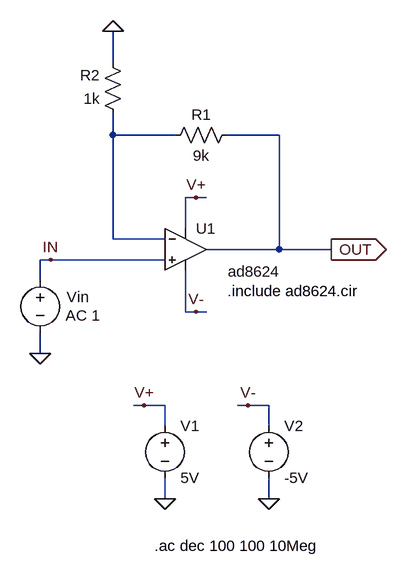
[diagram p0: schematic ad8624_test.asc]
ad8624_test.asc, the LTspice schematic file:
Version 4
SHEET 1 880 680
WIRE 0 -192 0 -240
WIRE 0 -80 0 -112
WIRE 96 -80 0 -80
WIRE 256 -80 176 -80
WIRE 128 16 112 16
WIRE 144 16 128 16
WIRE 112 64 112 16
WIRE 0 80 0 -80
WIRE 80 80 0 80
WIRE 256 96 256 -80
WIRE 256 96 144 96
WIRE 336 96 256 96
WIRE -96 112 -112 112
WIRE 80 112 -96 112
WIRE -112 144 -112 112
WIRE 112 192 112 128
WIRE 128 192 112 192
WIRE 144 192 128 192
WIRE -112 256 -112 224
WIRE 48 336 32 336
WIRE 80 336 48 336
WIRE 208 336 192 336
WIRE 240 336 208 336
WIRE 80 368 80 336
WIRE 240 368 240 336
WIRE 80 480 80 448
WIRE 240 480 240 448
FLAG 80 480 0
FLAG 240 480 0
FLAG 48 336 V+
FLAG 208 336 V-
FLAG 128 16 V+
FLAG 128 192 V-
FLAG -112 256 0
FLAG 336 96 OUT
IOPIN 336 96 Out
FLAG -96 112 IN
FLAG 0 -240 0
SYMBOL Opamps\\opamp2 112 32 R0
WINDOW 3 65 98 Left 2
SYMATTR Value ad8624
SYMATTR InstName U1
SYMBOL voltage 80 352 R0
SYMATTR InstName V1
SYMATTR Value 5V
SYMBOL voltage 240 352 R0
SYMATTR InstName V2
SYMATTR Value -5V
SYMBOL voltage -112 128 R0
WINDOW 0 41 41 Left 2
WINDOW 123 39 70 Left 2
WINDOW 39 0 0 Left 2
SYMATTR InstName Vin
SYMATTR Value2 AC 1
SYMATTR Value ""
SYMBOL res 192 -96 R90
WINDOW 0 0 56 VBottom 2
WINDOW 3 32 56 VTop 2
SYMATTR InstName R1
SYMATTR Value 9k
SYMBOL res 16 -96 R180
WINDOW 0 36 76 Left 2
WINDOW 3 36 40 Left 2
SYMATTR InstName R2
SYMATTR Value 1k
TEXT 176 160 Left 2 !.include ad8624.cir
TEXT 64 552 Left 2 !.ac dec 100 100 10Meg

The netlist it stands for:
* ad8624_test.asc
XU1 IN N001 V+ V- OUT ad8624  ; pins In+ In- V+ V- OUT
V1 V+ 0 5V
V2 V- 0 -5V
Vin IN 0 AC 1
R1 OUT N001 9k
R2 N001 0 1k
.include ad8624.cir
.ac dec 100 100 10Meg
.backanno
.end